# EAGLE design G1Tech-EnergyMonitor04 (EAGLE 9.3.1)
CNAME: Energy Monitor; CREVISION: A; DESIGNER: Nickolay G.
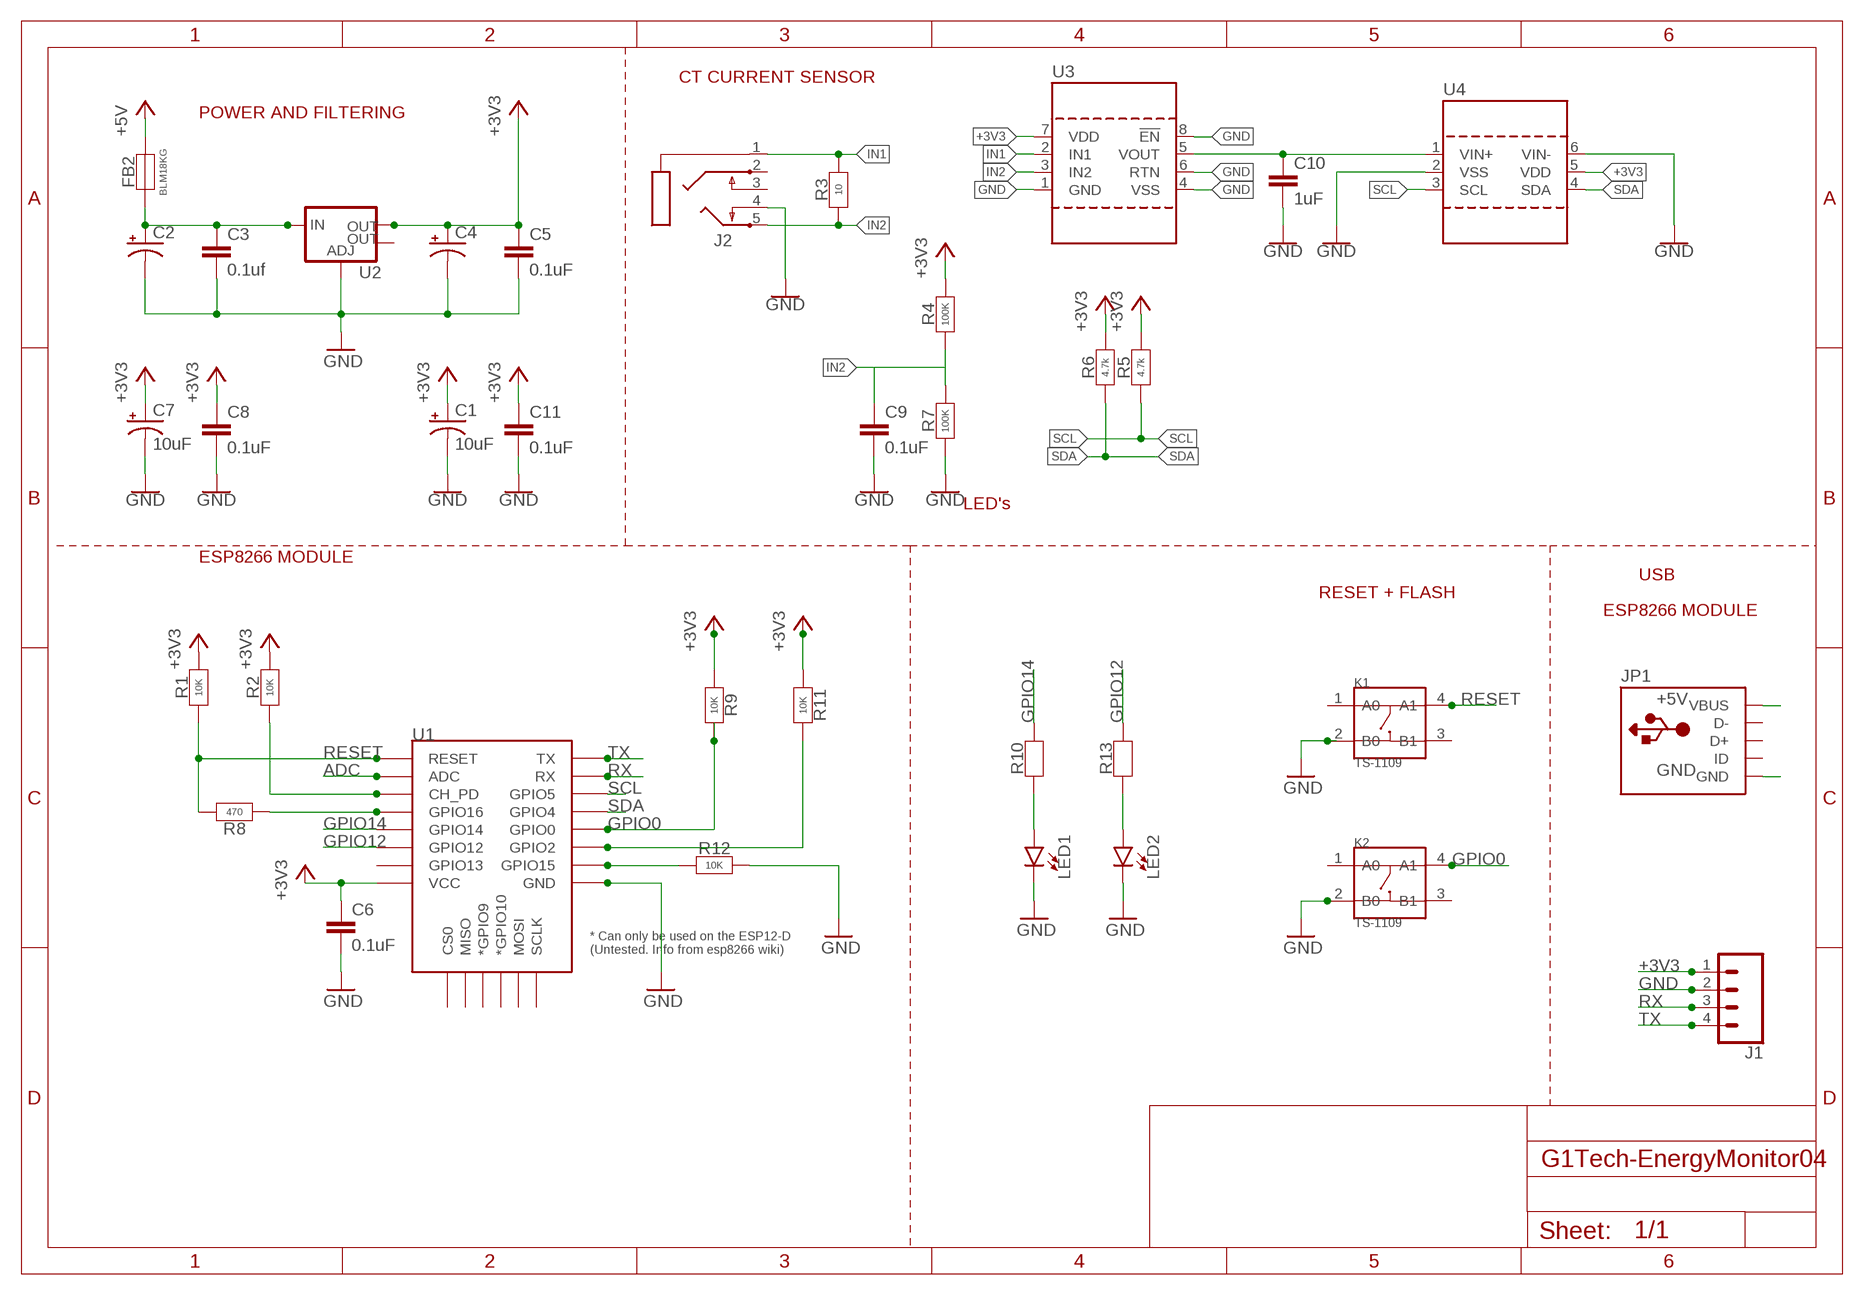
[diagram p0: schematic, sheet 1]

## Parts
C1  10uF  C-TYPE-A  [TYPE-A]
C2  C-TYPE-A  [TYPE-A]
C3  0.1uf  C0805  [C0805]
C4  C-TYPE-A  [TYPE-A]
C5  0.1uF  C0805  [C0805]
C6  0.1uF  C0603  [C0603]
C7  10uF  C-TYPE-A  [TYPE-A]
C8  0.1uF  C0603  [C0603]
C9  0.1uF  C0603  [C0603]
C10  1uF  C0603  [C0603]
C11  0.1uF  C0603  [C0603]
FB2  BLM18KG  FERRITE-BEAD-0603  [FB-0603]
J1  CONN_04  [1X04]
J2  PJ-3126-5A  [PJ-3126-5A]
JP1  USB-MICRO-B-1A  [USB-MICRO]
K1  TS-1109  DIP-BUTTON-4P  [SW4-6.0X6.0X5.0MM]
K2  TS-1109  DIP-BUTTON-4P  [SW4-6.0X6.0X5.0MM]
LED1  LED0603  [LED0603]
LED2  LED0603  [LED0603]
R1  10K  YAGEO-R0603  [YAGEO-R0603]
R2  10K  YAGEO-R0603  [YAGEO-R0603]
R3  10  YAGEO-R0603  [YAGEO-R0603]
R4  100K  YAGEO-R0603  [YAGEO-R0603]
R5  4.7k  YAGEO-R0603  [YAGEO-R0603]
R6  4.7k  YAGEO-R0603  [YAGEO-R0603]
R7  100K  YAGEO-R0603  [YAGEO-R0603]
R8  470  YAGEO-R0603  [YAGEO-R0603]
R9  10K  YAGEO-R0603  [YAGEO-R0603]
R10  YAGEO-R0603  [YAGEO-R0603]
R11  10K  YAGEO-R0603  [YAGEO-R0603]
R12  10K  YAGEO-R0603  [YAGEO-R0603]
R13  YAGEO-R0603  [YAGEO-R0603]
U1  ESP12ESMD  [ESP12E-SMD]
U2  V_REG_LM1117SOT223  [SOT223]
U3  LTC1966  [MS8]
U4  MCP3425  [SOT23-6]

## Nets
+3V3: C1.A C4.A C5.1 C6.1 C7.A C8.1 C11.1 J1.1 R1.2 R2.2 R4.2 R5.2 R6.2 R9.1 R11.1 U1.VCC U2.2(OUT) U3.7(VDD) U4.5(VDD)
+5V: FB2.2 JP1.VBUS
ADC: U1.ADC
GND: C1.C C2.C C3.2 C4.C C5.2 C6.2 C7.C C8.2 C9.2 C10.2 C11.2 J1.2 J2.4 JP1.GND K1.2(B0) K2.2(B0) LED1.C LED2.C R7.1 R12.2 U1.GND U2.1(ADJ) U3.1(GND) U3.4(VSS) U3.6(RTN) U3.8(!EN) U4.2(VSS) U4.6(VIN-)
GPIO0: K2.4(A1) R9.2 U1.GPIO0
GPIO12: R13.2 U1.GPIO12
GPIO14: R10.2 U1.GPIO14
IN1: J2.1 R3.2 U3.2(IN1)
IN2: C9.1 J2.5 R3.1 R4.1 R7.2 U3.3(IN2)
N$1: R12.1 U1.GPIO15
N$2: R11.2 U1.GPIO2
N$3: LED1.A R10.1
N$4: C2.A C3.1 FB2.1 U2.3(IN)
N$5: R8.1 U1.GPIO16
N$6: LED2.A R13.1
N$21: R2.1 U1.CH_PD
RESET: K1.4(A1) R1.1 R8.2 U1.RESET
RX: J1.3 U1.RXD0(RX)
SCL: R5.1 U1.GPIO5 U4.3(SCL)
SDA: R6.1 U1.GPIO4 U4.4(SDA)
TX: J1.4 U1.TXD0(TX)
VIN+: C10.1 U3.5(VOUT) U4.1(VIN+)
Unconnected: J2.2 J2.3 JP1.D+ JP1.D- JP1.ID K1.1(A0) K1.3(B1) K2.1(A0) K2.3(B1) U1.CS0 U1.GPIO9(*GPIO9) U1.GPIO10(*GPIO10) U1.GPIO13 U1.MISO U1.MOSI U1.SCLK U2.4(OUT)

## Notes on the sheet
- CT CURRENT SENSOR
- POWER AND FILTERING
- LED's
- ESP8266 MODULE
- USB
- RESET + FLASH
- ESP8266 MODULE

## Library data of the parts
C1 C2 C4 C7 = G1Tech-Capacitors:C-TYPE-A
C3 C5 = G1Tech-Capacitors:C0805
C6 C8-C11 = G1Tech-Capacitors:C0603
FB2 = G1Tech-Filters:FERRITE-BEAD-0603: BLM18KG101TN1D https://media.digikey.com/pdf/Data%20Sheets/Murata%20PDFs/BLM18yyyyyyN1x.pdf
J1 = SparkFun-Connectors:CONN_04: Multi connection point. Often used as Generic Header-pin footprint for 0.1 inch spaced/style header connections On any of the 0.1 inch spaced packages, you can populate with these: Break Away Headers - Straight <https://www.sparkfun.com/products/116> (PRT-00116) Break Away Male Headers - Right Angle <https://www.sparkfun.com/products/553> (PRT-00553) Female Headers <https://www.sparkfun.com/products/115> (PRT-00115) Break Away Headers - Machine Pin <https://www.sparkfun.com/products/117> (PRT-00117) Break Away Female Headers - Swiss Machine Pin <https://www.sparkfun.com/products/743> (PRT-00743) For SCREWTERMINALS and SPRING TERMINALS visit here: Screw Terimnals on SparkFun.com <https://www.sparkfun.com/search/results?term=Screw+Terminals> (5mm/3.5mm/2.54mm spacing) This device is also useful as a general connection point to wire up your design to another part of your project. Our various solder wires solder well into these plated through hole pads. Hook-Up Wire - Assortment (Stranded, 22 AWG) <https://www.sparkfun.com/products/11375> (PRT-11375) Hook-Up Wire - Assortment (Solid Core, 22 AWG) <https://www.sparkfun.com/products/11367> (PRT-11367) View the entire wire category on our website here <https://www.sparkfun.com/categories/141> Special notes: Molex polarized connector foot print use with SKU : PRT-08231 with associated crimp pins and housings. 1MM SMD Version SKU: PRT-10208; PROD_ID: CONN-09696
J2 = G1Tech-Connectors:PJ-3126-5A
JP1 = G1Tech-Connectors:USB-MICRO-B-1A
K1 K2 = Seeed-OPL-Button:DIP-BUTTON-4P: 311020024; MPN: TS-1109
LED1 LED2 = G1Tech-LED:LED0603
R1-R13 = G1Tech-Resistors:YAGEO-R0603: YAGEO Resistor R0603
U1 = esp8266modules:ESP12E: ESP12E Module
U2 = SparkFun-IC-Power:V_REG_LM1117: Voltage Regulator LM1117 Standard adjustable voltage regulator but in SMD form. Spark Fun Electronics SKU : COM-00595; PROD_ID: VREG-08170
U3 = G1Tech-Integrated-Circuits:LTC1966
U4 = G1Tech-Integrated-Circuits:MCP3425: IC ADC 16BIT I2C PROGBL SOT23-6

## Board
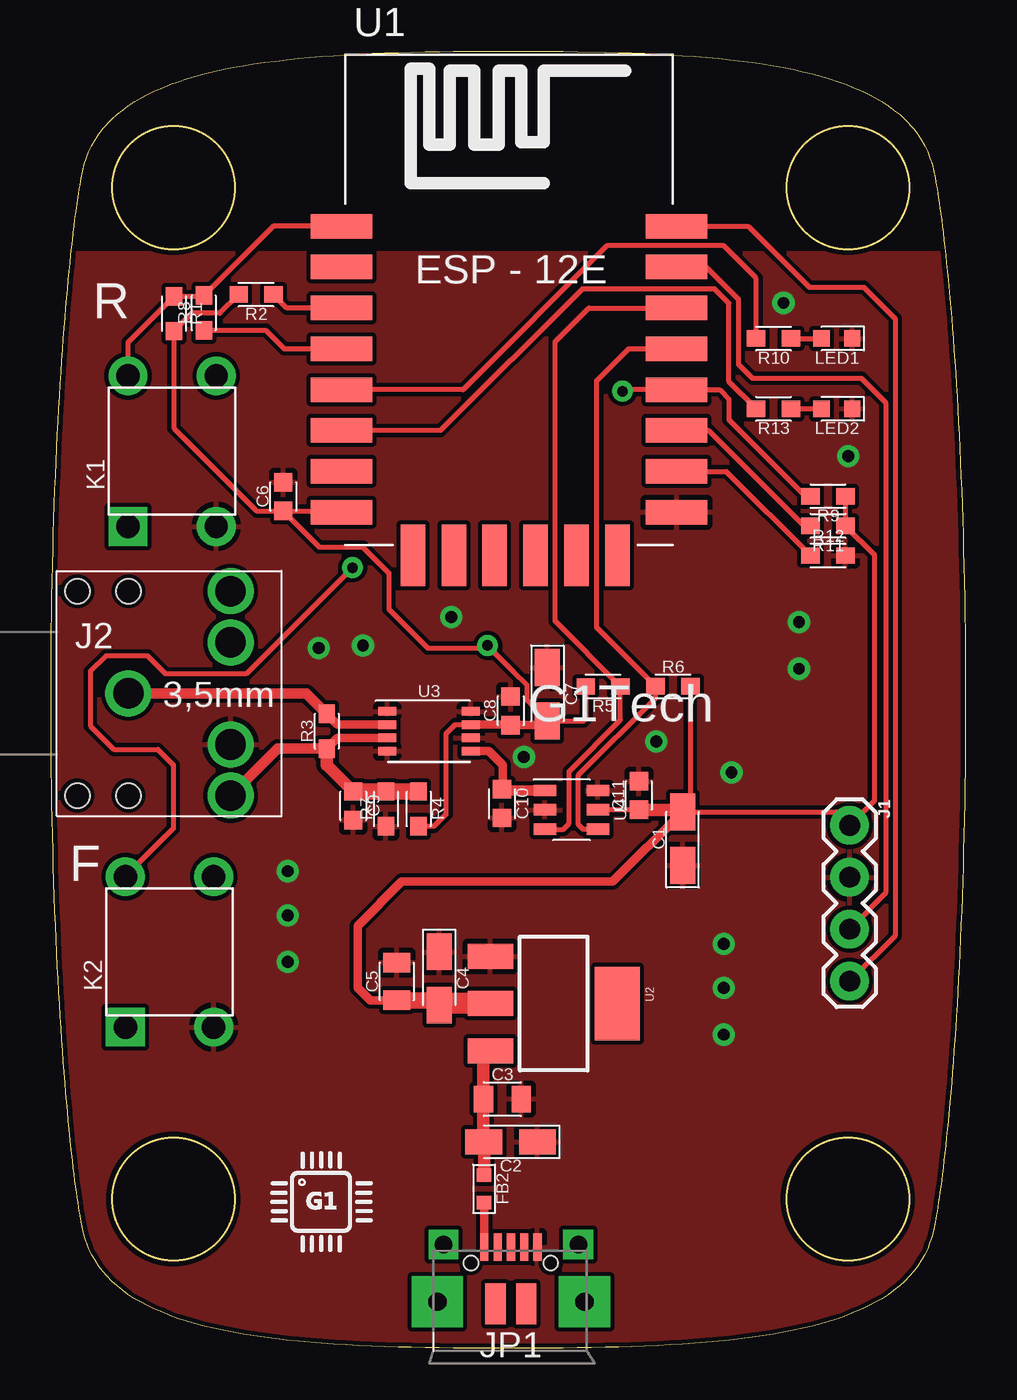
[diagram p1: board, top side]
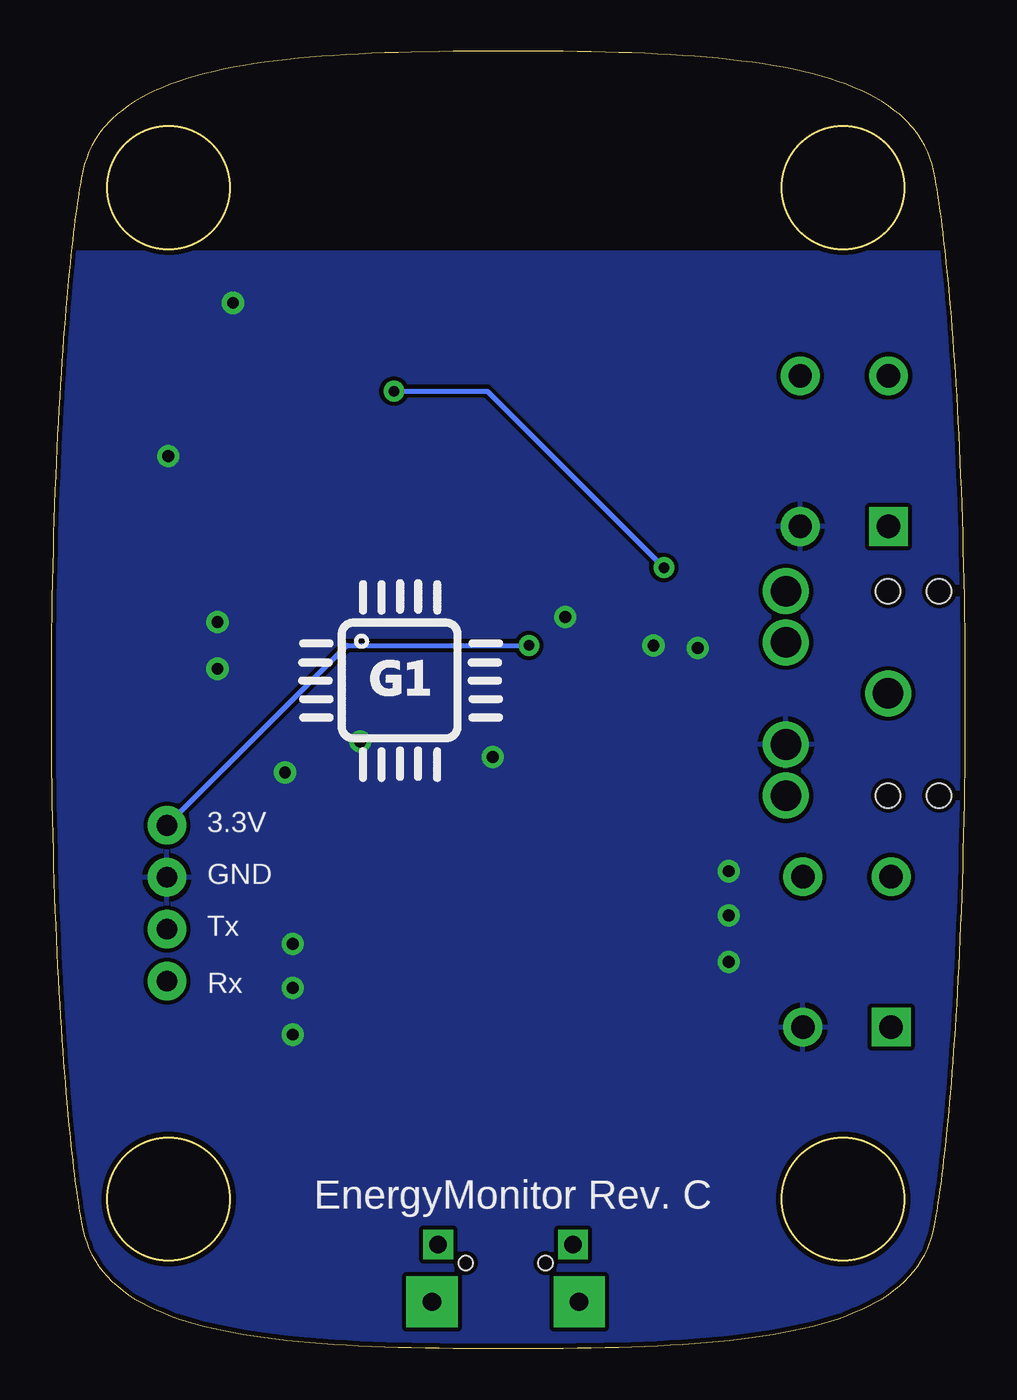
[diagram p2: board, bottom side, seen from below]

Size 44.74 x 63.5 mm. Coordinates in mm from the lower left corner, seen from the top.
Outline: 22.22,0 22.95,0 23.67,0 24.37,0.01 25.07,0.01 25.76,0.02 26.43,0.03 27.1,0.05 27.76,0.07 28.41,0.09 29.05,0.11 29.68,0.14 30.29,0.18 30.9,0.21 31.5,0.25 32.08,0.3 32.66,0.35 33.22,0.41 33.76,0.47 34.3,0.54 34.82,0.61 35.32,0.7 35.83,0.78 36.31,0.88 36.77,0.98 37.23,1.09 37.67,1.21 38.09,1.33 38.51,1.46 38.91,1.6 39.28,1.76 39.66,1.91 40.01,2.08 40.33,2.26 40.66,2.44 40.96,2.64 41.24,2.85 41.51,3.06 41.76,3.29 41.99,3.53 42.21,3.77 42.41,4.03 42.58,4.31 42.75,4.58 42.89,4.88 43,5.19 43.11,5.51 43.2,5.84 43.25,6.19 43.28,6.34 43.31,6.51 43.35,6.71 43.38,6.91 43.42,7.14 43.45,7.39 43.49,7.64 43.53,7.92 43.57,8.22 43.61,8.52 43.65,8.85 43.69,9.2 43.73,9.55 43.77,9.93 43.81,10.33 43.85,10.73 43.89,11.15 43.97,12.05 44.02,12.52 44.06,13.01 44.1,13.51 44.14,14.02 44.18,14.57 44.21,15.11 44.25,15.67 44.29,16.26 44.33,16.84 44.36,17.45 44.39,18.08 44.43,18.72 44.46,19.37 44.52,20.72 44.55,21.42 44.57,22.13 44.6,22.85 44.62,23.59 44.64,24.35 44.66,25.11 44.68,25.89 44.69,26.7 44.71,27.5 44.72,28.32 44.73,29.16 44.73,30 44.74,30.87 44.74,32.55 44.73,33.41 44.73,34.25 44.72,35.1 44.71,35.92 44.69,36.72 44.68,37.52 44.66,38.31 44.64,39.07 44.62,39.83 44.6,40.57 44.57,41.29 44.55,42.01 44.52,42.71 44.49,43.38 44.46,44.06 44.43,44.71 44.39,45.34 44.36,45.98 44.33,46.59 44.29,47.18 44.25,47.76 44.21,48.33 44.18,48.87 44.14,49.41 44.1,49.93 44.06,50.43 44.02,50.92 43.97,51.4 43.89,52.3 43.85,52.72 43.81,53.12 43.77,53.52 43.73,53.9 43.69,54.25 43.65,54.6 43.61,54.93 43.57,55.23 43.53,55.54 43.49,55.81 43.45,56.06 43.42,56.32 43.38,56.54 43.35,56.74 43.31,56.94 43.28,57.12 43.25,57.27 43.2,57.62 43.11,57.95 43,58.27 42.89,58.58 42.75,58.87 42.58,59.15 42.41,59.43 42.21,59.69 41.76,60.18 41.51,60.4 41.24,60.62 40.96,60.83 40.66,61.02 40.33,61.21 40.01,61.39 39.66,61.56 39.28,61.71 38.91,61.87 38.51,62.01 38.09,62.14 37.67,62.27 37.23,62.39 36.77,62.49 36.31,62.6 35.83,62.7 35.32,62.78 34.82,62.87 34.3,62.95 33.22,63.08 32.66,63.14 32.08,63.19 31.5,63.24 30.9,63.28 30.29,63.32 29.68,63.35 29.05,63.38 28.41,63.41 27.76,63.43 27.1,63.45 25.76,63.48 25.07,63.49 24.37,63.49 23.67,63.5 22.95,63.5 22.24,63.5
Outline: 22.49,0 21.79,0 21.07,0 20.37,0.01 19.67,0.01 18.98,0.02 18.31,0.03 17.63,0.05 16.97,0.07 16.33,0.09 15.69,0.11 15.06,0.14 14.44,0.18 13.83,0.21 13.24,0.25 12.08,0.35 11.52,0.41 10.98,0.47 10.44,0.54 9.92,0.61 9.41,0.7 8.91,0.78 8.43,0.88 7.5,1.09 7.06,1.21 6.64,1.33 6.22,1.46 5.83,1.6 5.45,1.76 5.08,1.91 4.73,2.08 4.4,2.26 4.08,2.44 3.78,2.64 3.5,2.85 3.23,3.06 2.98,3.29 2.75,3.53 2.53,3.77 2.33,4.03 2.16,4.31 1.99,4.58 1.85,4.88 1.62,5.51 1.54,5.84 1.48,6.19 1.45,6.34 1.42,6.51 1.39,6.71 1.35,6.91 1.32,7.14 1.28,7.39 1.25,7.64 1.21,7.92 1.17,8.22 1.13,8.52 1.09,8.85 1.05,9.2 1.01,9.55 0.97,9.92 0.89,10.72 0.84,11.15 0.8,11.6 0.76,12.04 0.72,12.51 0.68,13.01 0.64,13.5 0.6,14.02 0.56,14.56 0.52,15.1 0.48,15.67 0.45,16.25 0.41,16.84 0.38,17.45 0.34,18.08 0.31,18.71 0.28,19.36 0.25,20.04 0.22,20.71 0.19,21.41 0.16,22.13 0.14,22.84 0.12,23.58 0.1,24.34 0.08,25.1 0.06,25.89 0.04,26.69 0.03,27.49 0.02,28.31 0.01,29.15 0,30 0,30.86 0,31.74
Outline: 0,31.7 0,32.58 0,33.44 0.01,34.28 0.02,35.13 0.03,35.95 0.04,36.75 0.06,37.55 0.08,38.33 0.1,39.09 0.12,39.85 0.14,40.59 0.16,41.31 0.19,42.03 0.22,42.73 0.25,43.4 0.28,44.08 0.31,44.73 0.34,45.36 0.38,46 0.41,46.61 0.45,47.19 0.48,47.78 0.52,48.34 0.56,48.89 0.6,49.43 0.64,49.95 0.68,50.44 0.72,50.94 0.76,51.41 0.8,51.86 0.84,52.3 0.89,52.73 0.93,53.13 0.97,53.53 1.01,53.9 1.05,54.26 1.09,54.61 1.13,54.93 1.17,55.24 1.21,55.54 1.25,55.81 1.28,56.07 1.32,56.32 1.35,56.54 1.39,56.74 1.42,56.94 1.45,57.12 1.48,57.27 1.54,57.62 1.62,57.95 1.85,58.58 1.99,58.87 2.16,59.15 2.33,59.43 2.53,59.69 2.98,60.18 3.23,60.4 3.5,60.62 3.78,60.83 4.08,61.02 4.4,61.21 4.73,61.39 5.08,61.56 5.45,61.71 5.83,61.87 6.22,62.01 6.64,62.14 7.06,62.27 7.5,62.39 8.43,62.6 8.91,62.7 9.41,62.78 9.92,62.87 10.44,62.95 10.98,63.01 11.52,63.08 12.08,63.14 12.66,63.19 13.24,63.24 13.83,63.28 14.44,63.32 15.06,63.35 15.69,63.38 16.33,63.41 16.97,63.43 17.63,63.45 18.31,63.46 18.98,63.48 19.67,63.49 20.37,63.49 21.07,63.5 21.79,63.5 22.51,63.5
Outline: circle at 5.98,7.31 radius 3
Outline: circle at 38.98,7.31 radius 3
Outline: circle at 38.98,56.81 radius 3
Outline: circle at 5.98,56.81 radius 3
Copper layers (1*16): Top 0.035mm / dielectric 1.5mm / Bottom 0.035mm
Design rules "SparkFun": minimum track width 8mil, minimum drill 20mil, track to track 8mil, track to pad 8mil, pad to pad 8mil, via to via 8mil, smd to smd 8mil, copper to edge 9mil, drill to drill 8mil, minimum pad ring 12mil, minimum via ring 10mil, stop-mask expansion 4mil, vias tented up to drill 20mil, thermal gap 10mil

### Footprints (pad centres in the part's own frame; a part is rotated, then mirrored left to right if it is on the bottom)
TYPE-A = smd 1.8 x 1.23: A 1.31,0; C -1.31,0
C0805 = smd 0.95 x 1.3: 1 -0.925,0; 2 0.925,0
C0603 = smd 0.9 x 0.9: 1 -0.7,0; 2 0.7,0
FB-0603 = smd 0.65 x 0.7: 1 -0.675,0; 2 0.675,0
1X04 = drill 1.016 pad 1.88: 1 0,0; 2 2.54,0; 3 5.08,0; 4 7.62,0
PJ-3126-5A = drill 1.5: 1 -5,0; 2 0,5; 3 0,2.5; 4 0,-2.5; 5 0,-5 | hole 1.2: -5,5; -7.5,5; -7.5,-5; -5,-5
USB-MICRO = smd 1 x 2: BS1 -0.75,-2; BS2 0.75,-2 | smd 0.4 x 1.35: D+ 0,0.775; D- -0.65,0.775; GND 1.3,0.775; ID 0.65,0.775; VBUS -1.3,0.775 | drill 0.85 pad 1.25 square: MT1 -3.3,0.9; MT2 3.3,0.9 | drill 0.9 pad 2.5 square: MT3 -3.6,-1.9; MT4 3.6,-1.9 | hole 0.7: -1.95,0; 1.95,0
SW4-6.0X6.0X5.0MM = drill 1.143 pad 1.905 square: 1 -3.683,2.159 | drill 1.143 pad 1.905: 2 -3.683,-2.159; 3 3.683,-2.159; 4 3.683,2.159
LED0603 = smd 0.8 x 0.8: A 0.75,0; C -0.75,0
YAGEO-R0603 = smd 0.9 x 0.8: 1 -0.85,0; 2 0.85,0
ESP12E-SMD = smd 3 x 1.2: ADC -8.3,3.8; CH_PD -8.3,1.8; GND 8.1,-8.2; GPIO0 8.1,-2.2; GPIO2 8.1,-4.2; GPIO4 8.1,-0.2; GPIO5 8.1,1.8; GPIO12 -8.3,-4.2; GPIO13 -8.3,-6.2; GPIO14 -8.3,-2.2; GPIO15 8.1,-6.2; GPIO16 -8.3,-0.2; RESET -8.3,5.8; RXD0 8.1,3.8; TXD0 8.1,5.8; VCC -8.3,-8.2 | smd 1.2 x 3: CS0 -4.8,-10.3; GPIO9 -0.8,-10.3; GPIO10 1.2,-10.3; MISO -2.8,-10.3; MOSI 3.2,-10.3; SCLK 5.2,-10.3
SOT223 = smd 1.219 x 2.235: 1 -2.311,-3.099; 2 0,-3.099; 3 2.311,-3.099 | smd 3.6 x 2.2: 4 0,3.099
MS8 = smd 0.42 x 0.88: 1 -0.975,-2.04; 2 -0.325,-2.04; 3 0.325,-2.04; 4 0.975,-2.04; 5 0.975,2.04; 6 0.325,2.04; 7 -0.325,2.04; 8 -0.975,2.04
SOT23-6 = smd 0.55 x 1.1: 1 -0.95,-1.3; 2 0,-1.3; 3 0.95,-1.3; 4 0.95,1.3; 5 0,1.3; 6 -0.95,1.3

### Placement (x,y rotation side)
C1  30.9,24.95 90 top
C2  22.48,10.11 180 top
C3  22.08,12.2 0 top
C4  18.98,18.11 270 top
C5  16.91,17.96 90 top
C6  11.36,41.69 90 top
C7  24.28,32.02 270 top
C8  22.48,31.21 90 top
C9  14.78,26.56 270 top
C10  22.06,26.66 270 top
C11  28.76,27.06 90 top
FB2  21.18,7.81 270 top
J1  39.07,25.6 270 top
J2  8.78,32.06 0 top
JP1  22.5,4.18 0 top
K1  5.92,43.92 90 top
K2  5.8,19.41 90 top
LED1  38.45,49.43 180 top
LED2  38.45,45.99 180 top
R1  6.01,50.64 270 top
R2  10.03,51.58 180 top
R3  13.48,30.21 90 top
R4  17.98,26.41 270 top
R5  27.01,32.4 180 top
R6  30.43,32.4 0 top
R7  16.38,26.41 90 top
R8  7.47,50.69 90 top
R9  38.01,41.71 180 top
R10  35.35,49.43 180 top
R11  38.01,40.26 180 top
R12  38.01,38.81 0 top
R13  35.35,45.99 180 top
U1  22.5,49.13 0 top
U2  24.59,16.88 270 top
U3  18.48,30.21 270 top
U4  25.46,26.36 270 top
U$1  [LOGO-G1TECH-5MM]  10.73,4.7 0 top
U$3  [LOGO-G1TECH-10MM]  32.63,27.74 0 bottom

### Tracks (layer width: path | path; a pad name or v marks a point on that pad's centre or on a via)
+3V3  (via drill 0.51)
  Top 0.254: C6.1 10.07,40.99 6.01,45.05 R1.2 6.88,50.66 8.26,50.66 R2.2 | C6.1 14.14,40.99 U1.VCC | R5.2 26.18,32.38 26.18,30.85 26.04,30.71 C7.A 23.26,31.73 23.26,32.5 22.62,33.14 | U3.7 19.77,30.53 19.32,30.09 19.32,26.15 18.73,25.56 R4.2 | C11.1 U4.5 | C1.A 31.13,26.26 | 31.13,26.26 38.41,26.26 J1.1 40.28,26.81 40.28,38.84 R11.1 R9.1 | 22.5,33.26 22.62,33.14 | C6.1 13.12,39.23 15.26,39.23 16.53,37.96 16.53,36.19 18.43,34.28 21.48,34.28 | R6.2 31.28,26.4 31.13,26.26 | v21.36,34.41 21.48,34.28 | 22.62,33.14 21.55,34.22 21.48,34.28
  Top 0.406: C5.1 15.61,17.04 15.01,17.64 15.01,20.69 17.16,22.85 27.49,22.85 C1.A | U3.7 22.46,30.53 C8.1 24.09,30.51 C7.A
  Top 0.61: C11.1 30.8,26.36 C1.A
  Top 0.813: C4.A 18.75,17.04 C5.1
  Top 1.016: U2.2 19.06,16.88 C4.A
  Bottom 0.254: J1.1 30.26,34.41 v21.36,34.41
+5V
  Top 0.406: JP1.VBUS 21.2,7.12 FB2.2
GND  (via drill 0.58)
  other vias: 13.1,34.28 15.26,34.41 11.58,23.36 11.58,21.2 11.58,18.91 32.91,19.8 32.91,17.64 32.91,15.36 36.6,33.26 36.6,35.55 33.29,28.18 29.61,29.71 35.83,51.17 39.01,43.68 19.58,35.8 23.13,28.95
  pour Bottom: -0.62,53.61 44.58,53.61 45.55,-1.93 -0.32,-2.23
  pour Top: -0.62,53.61 45.49,53.61 45.72,-2.47 -0.62,-2.67
GPIO0  (via drill 0.51)
  Top 0.254: R9.2 36.91,41.71 33.17,45.46 33.17,46.47 32.71,46.93 U1.GPIO0 28.03,46.93 v27.96,46.85 | v14.75,38.22 9.54,33.01 5.61,33.01 4.72,33.9 2.69,33.9 1.92,33.14 1.92,30.47 3.07,29.33 5.23,29.33 5.99,28.57 5.99,25.44 K2.4
  Bottom 0.254: v27.96,46.85 23.39,46.85 v14.75,38.22
GPIO12
  Top 0.254: R13.2 33.17,47.32 33.17,51.17 32.48,51.86 25.98,51.86 19.05,44.93 U1.GPIO12
GPIO14
  Top 0.254: R10.2 34.5,52.38 32.91,53.97 27.2,53.97 20.16,46.93 U1.GPIO14
IN1
  Top 0.406: U3.2 14.01,30.53 R3.2
  Top 0.508: J2.1 12.48,32.06 R3.2
IN2
  Top 0.406: U3.3 14.01,29.88 R3.1
  Top 0.508: J2.5 11.08,29.36 R3.1
  Top 0.61: R3.1 13.48,28.56 C9.1
  Top 0.813: C9.1 R7.2 R4.1
N$1
  Top 0.254: U1.GPIO15 33.04,42.93 R12.1
N$2
  Top 0.254: U1.GPIO2 32.17,44.93 36.84,40.26 R11.2
N$3
  Top 0.254: R10.1 LED1.A
N$4
  Top 0.61: FB2.1 C2.A 21.15,10.13 C3.1 21.15,14.22 U2.3
N$5
  Top 0.254: R8.1 10.5,49.83 11.41,48.93 U1.GPIO16
N$6
  Top 0.254: R13.1 LED2.A
N$21
  Top 0.254: U1.CH_PD 11.54,50.93 R2.1
RESET
  Top 0.254: U1.RESET 10.87,54.93 R8.2 7.43,51.49 R1.1 3.76,49.24 K1.4
RX
  Top 0.254: U1.RXD0 32.06,52.93 33.62,51.36 33.62,48.17 34.31,47.49 39.64,47.49 40.84,46.29 40.84,22.29 J1.3
SCL
  Top 0.254: U4.3 25.06,25.41 25.34,25.7 25.34,28.25 27.86,30.76 R5.1 24.66,35.6 24.66,49.27 26.32,50.93 U1.GPIO5
SDA
  Top 0.254: U4.4 26.03,25.41 25.8,25.64 25.8,28.06 29.58,31.83 R6.1 26.69,35.29 26.69,47.36 28.26,48.93 U1.GPIO4
TX
  Top 0.254: U1.TXD0 34.11,54.93 37.1,51.93 39.77,51.93 41.29,50.41 41.29,20.2 J1.4
VIN+
  Top 0.406: U3.5 21.42,29.23 22.11,28.55 22.11,27.31
  Top 0.508: U4.1 22.11,27.31 C10.1

### Text on the board
tPlace: R | G1Tech | F
bPlace: 3.3V | GND | Tx | Rx | EnergyMonitor Rev. C